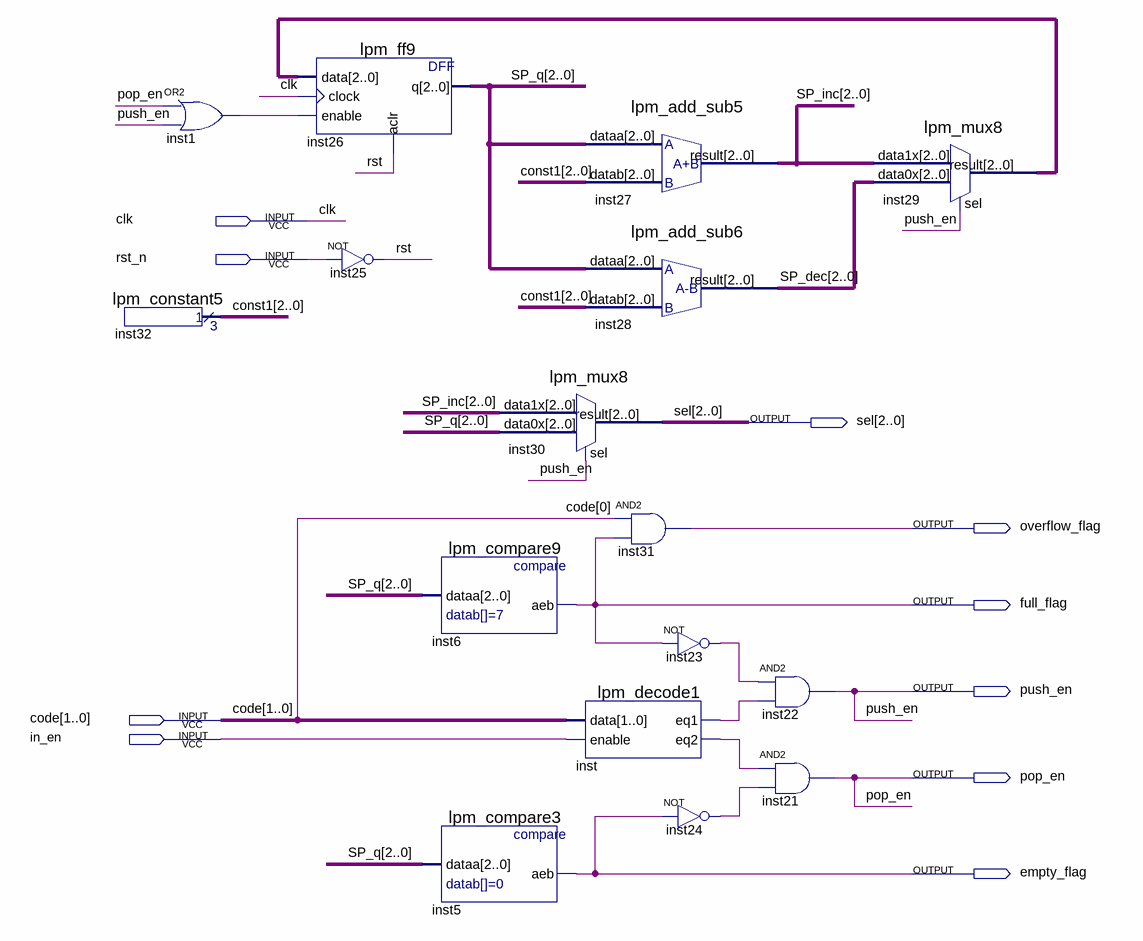
[diagram p0: schematic sheet]
// Quartus schematic stack_control.bdf as structural Verilog: 16 symbols, 10 pins
module stack_control (
  input  clk,
  input  rst_n,
  input  [1:0] code,
  input  in_en,
  output [2:0] sel,
  output overflow_flag,
  output full_flag,
  output push_en,
  output pop_en,
  output empty_flag
);

  wire inst1_out, inst23_out, inst24_out, inst_eq1, inst_eq2, rst;
  wire [2:0] const1, inst29_result, SP_dec, SP_inc, SP_q;

  lpm_constant5 inst32 (.result(const1));
  or inst1 (inst1_out, pop_en, push_en);
  lpm_ff9 inst26 (.data(inst29_result), .clock(clk), .enable(inst1_out), .aclr(rst), .q(SP_q));
  not inst25 (rst, rst_n);
  lpm_compare9 inst6 (.dataa(SP_q), .aeb(full_flag));
  lpm_compare3 inst5 (.dataa(SP_q), .aeb(empty_flag));
  lpm_mux8 inst30 (.data1x(SP_inc), .data0x(SP_q), .sel(push_en), .result(sel));
  lpm_decode1 inst (.data(code), .enable(in_en), .eq1(inst_eq1), .eq2(inst_eq2));
  lpm_add_sub5 inst27 (.dataa(SP_q), .datab(const1), .result(SP_inc));
  lpm_add_sub6 inst28 (.dataa(SP_q), .datab(const1), .result(SP_dec));
  and inst31 (overflow_flag, code[0], full_flag);
  not inst23 (inst23_out, full_flag);
  not inst24 (inst24_out, empty_flag);
  and inst22 (push_en, inst23_out, inst_eq1);
  and inst21 (pop_en, inst_eq2, inst24_out);
  lpm_mux8 inst29 (.data1x(SP_inc), .data0x(SP_dec), .sel(push_en), .result(inst29_result));
endmodule
